# Altium project CHIP_v1_0.PrjPcb
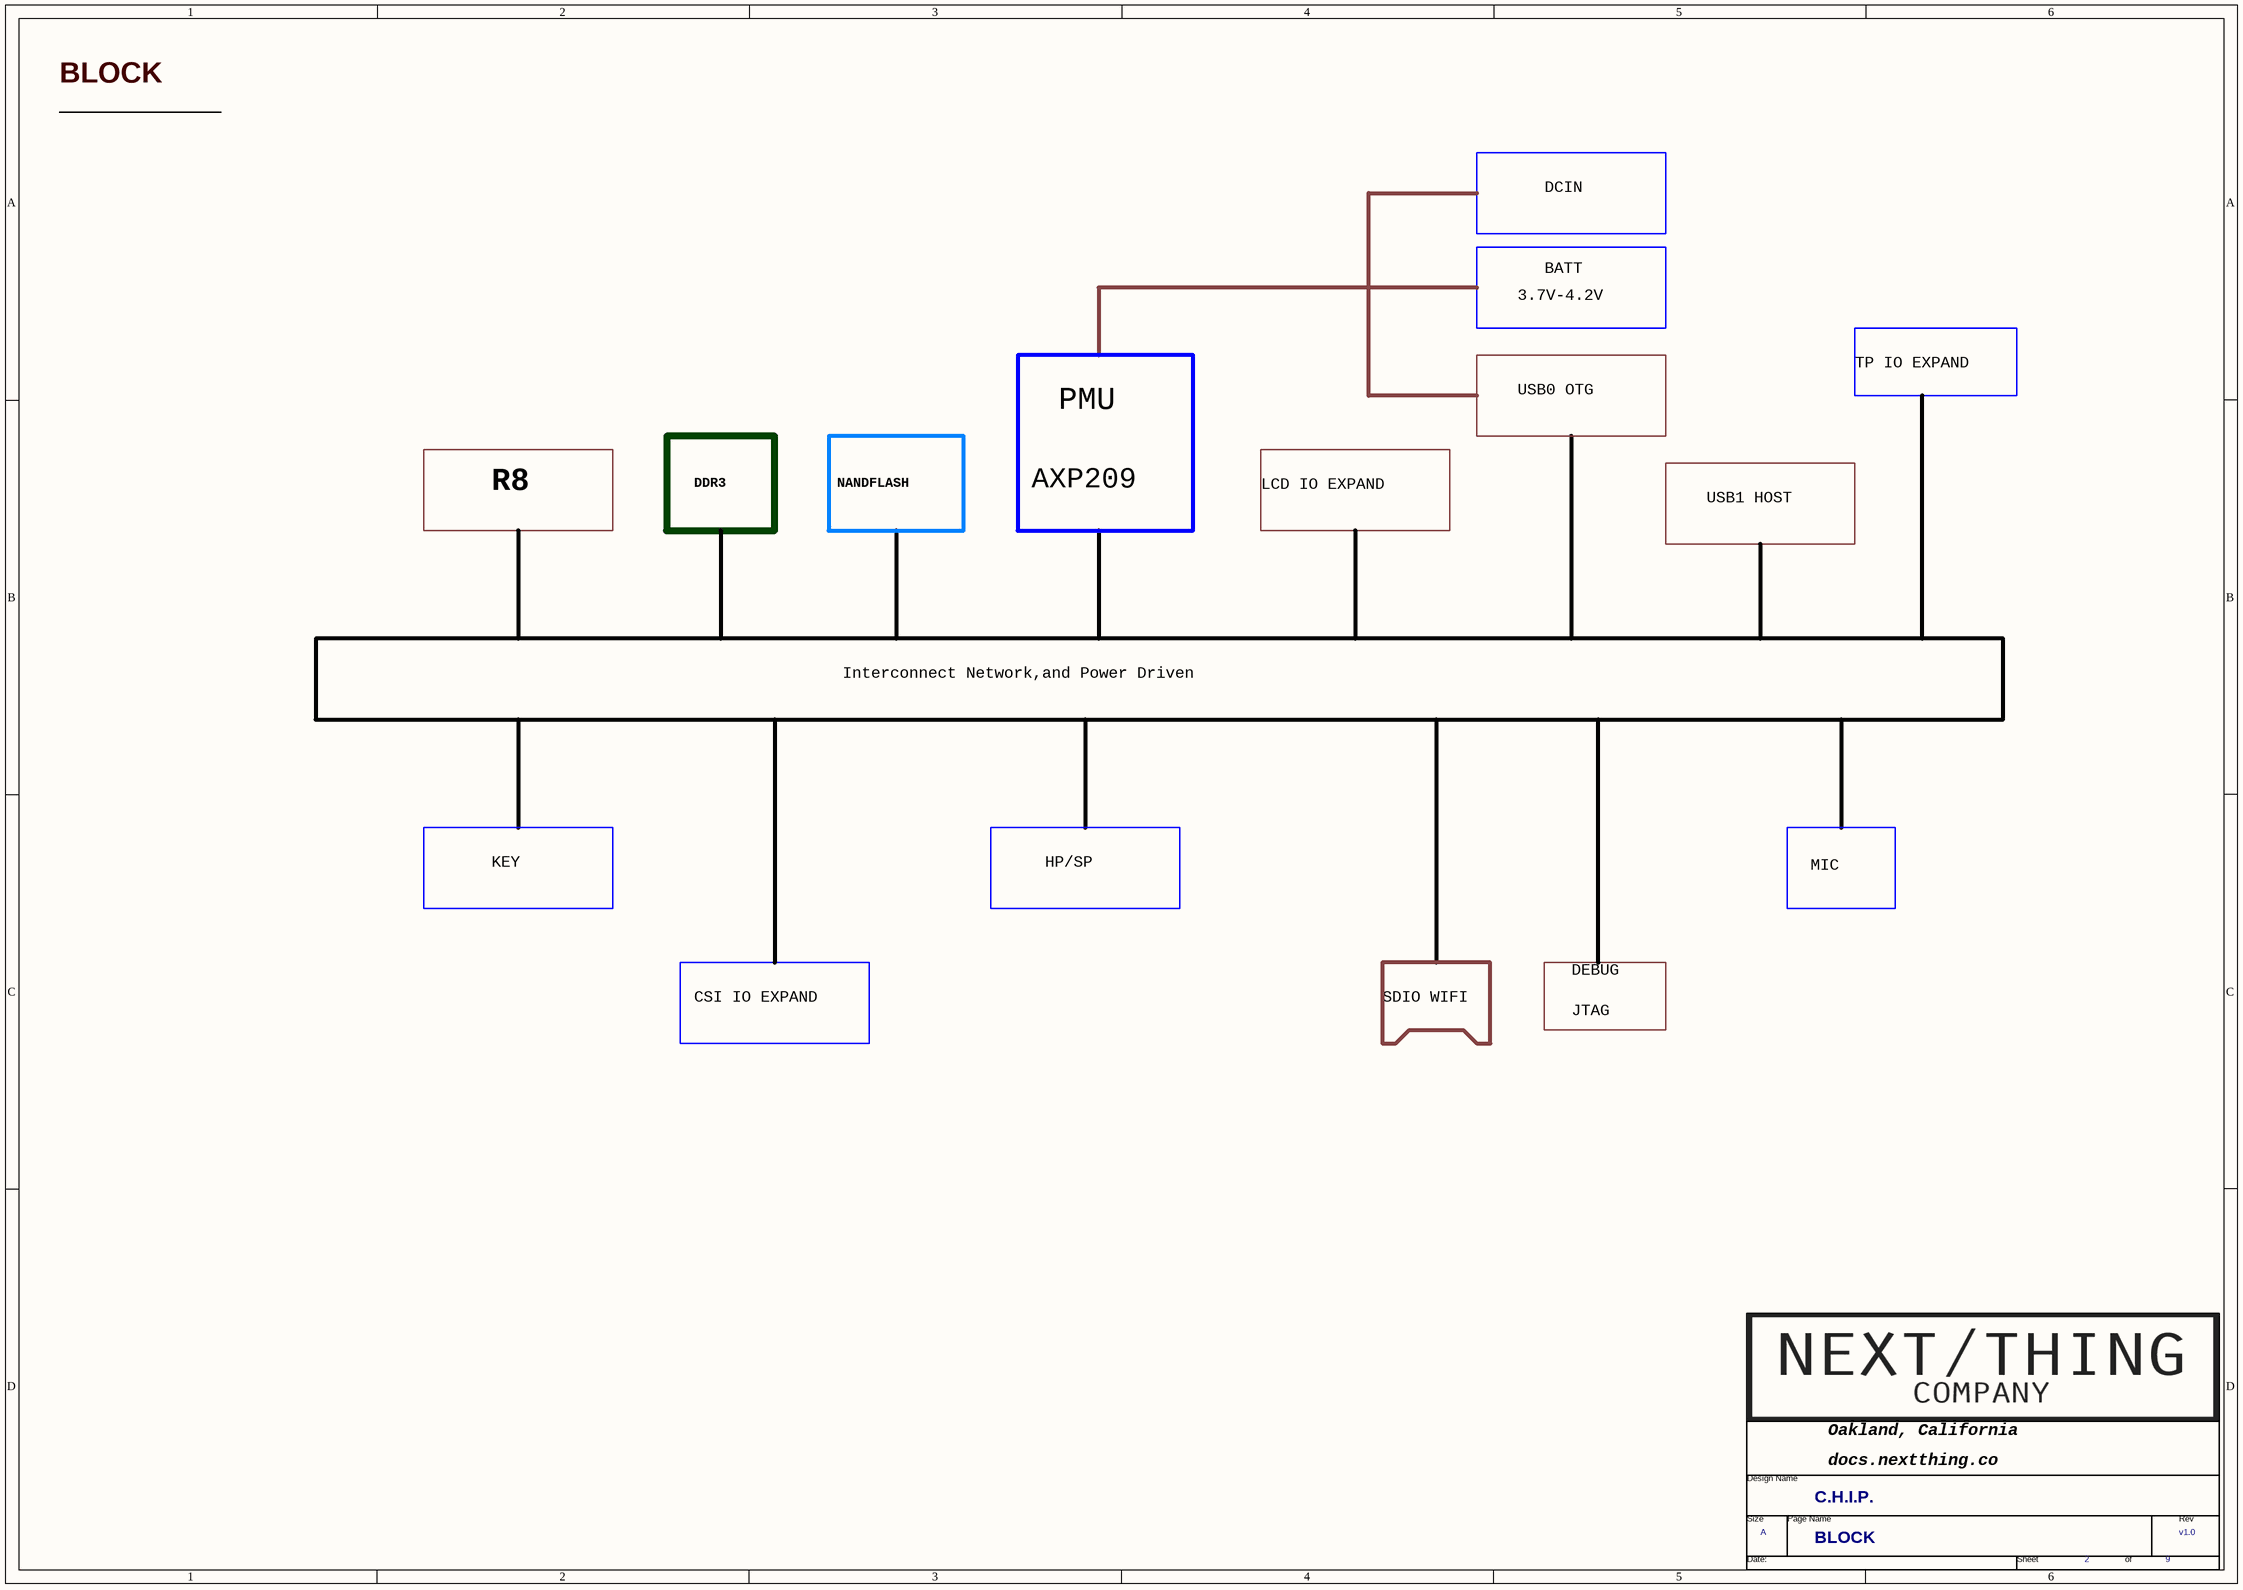
[diagram p0: 02 BLOCK.SchDoc]
4 sheets, 125 parts. Net scope: global (net labels, ports and power ports of the same name join across sheets).
Sheets:
  02 BLOCK.SchDoc
  05 MISC.SchDoc
  07 USB.SchDoc
  08 BESIDE CPU.SchDoc

## Sheet 02 BLOCK.SchDoc
size 420 x 297 mm

### Parts
(Parts that share a designator on the sheet are numbered #1, #2 ... from top to bottom, then left to right.)
*#1  Page Count: 9  Page Number: 2  Page Size: A  Title: C.H.I.P.  RevCode: v1.0  Doc: BLOCK  (hidden comment: TitleBlock1-nextthing)  (graphical)

### Notes on the sheet
- BLOCK
- DCIN
- 3.7V-4.2V
- BATT
- USB0 OTG
- TP IO EXPAND
- PMU
- R8
- DDR3
- NANDFLASH
- AXP209
- LCD IO EXPAND
- USB1 HOST
- Interconnect Network,and Power Driven
- KEY
- HP/SP
- MIC
- CSI IO EXPAND
- SDIO WIFI
- DEBUG
- JTAG
- (in symbol TitleBlock1-nextthing) Oakland, California; Design Name; docs.nextthing.co /; Size; Page Name; Rev; Date:; Sheet; of

### Library data of the parts
*#1 = TitleBlock1-nextthing: Page Create Date: March  8, 1995

## Sheet 05 MISC.SchDoc
size 420 x 297 mm
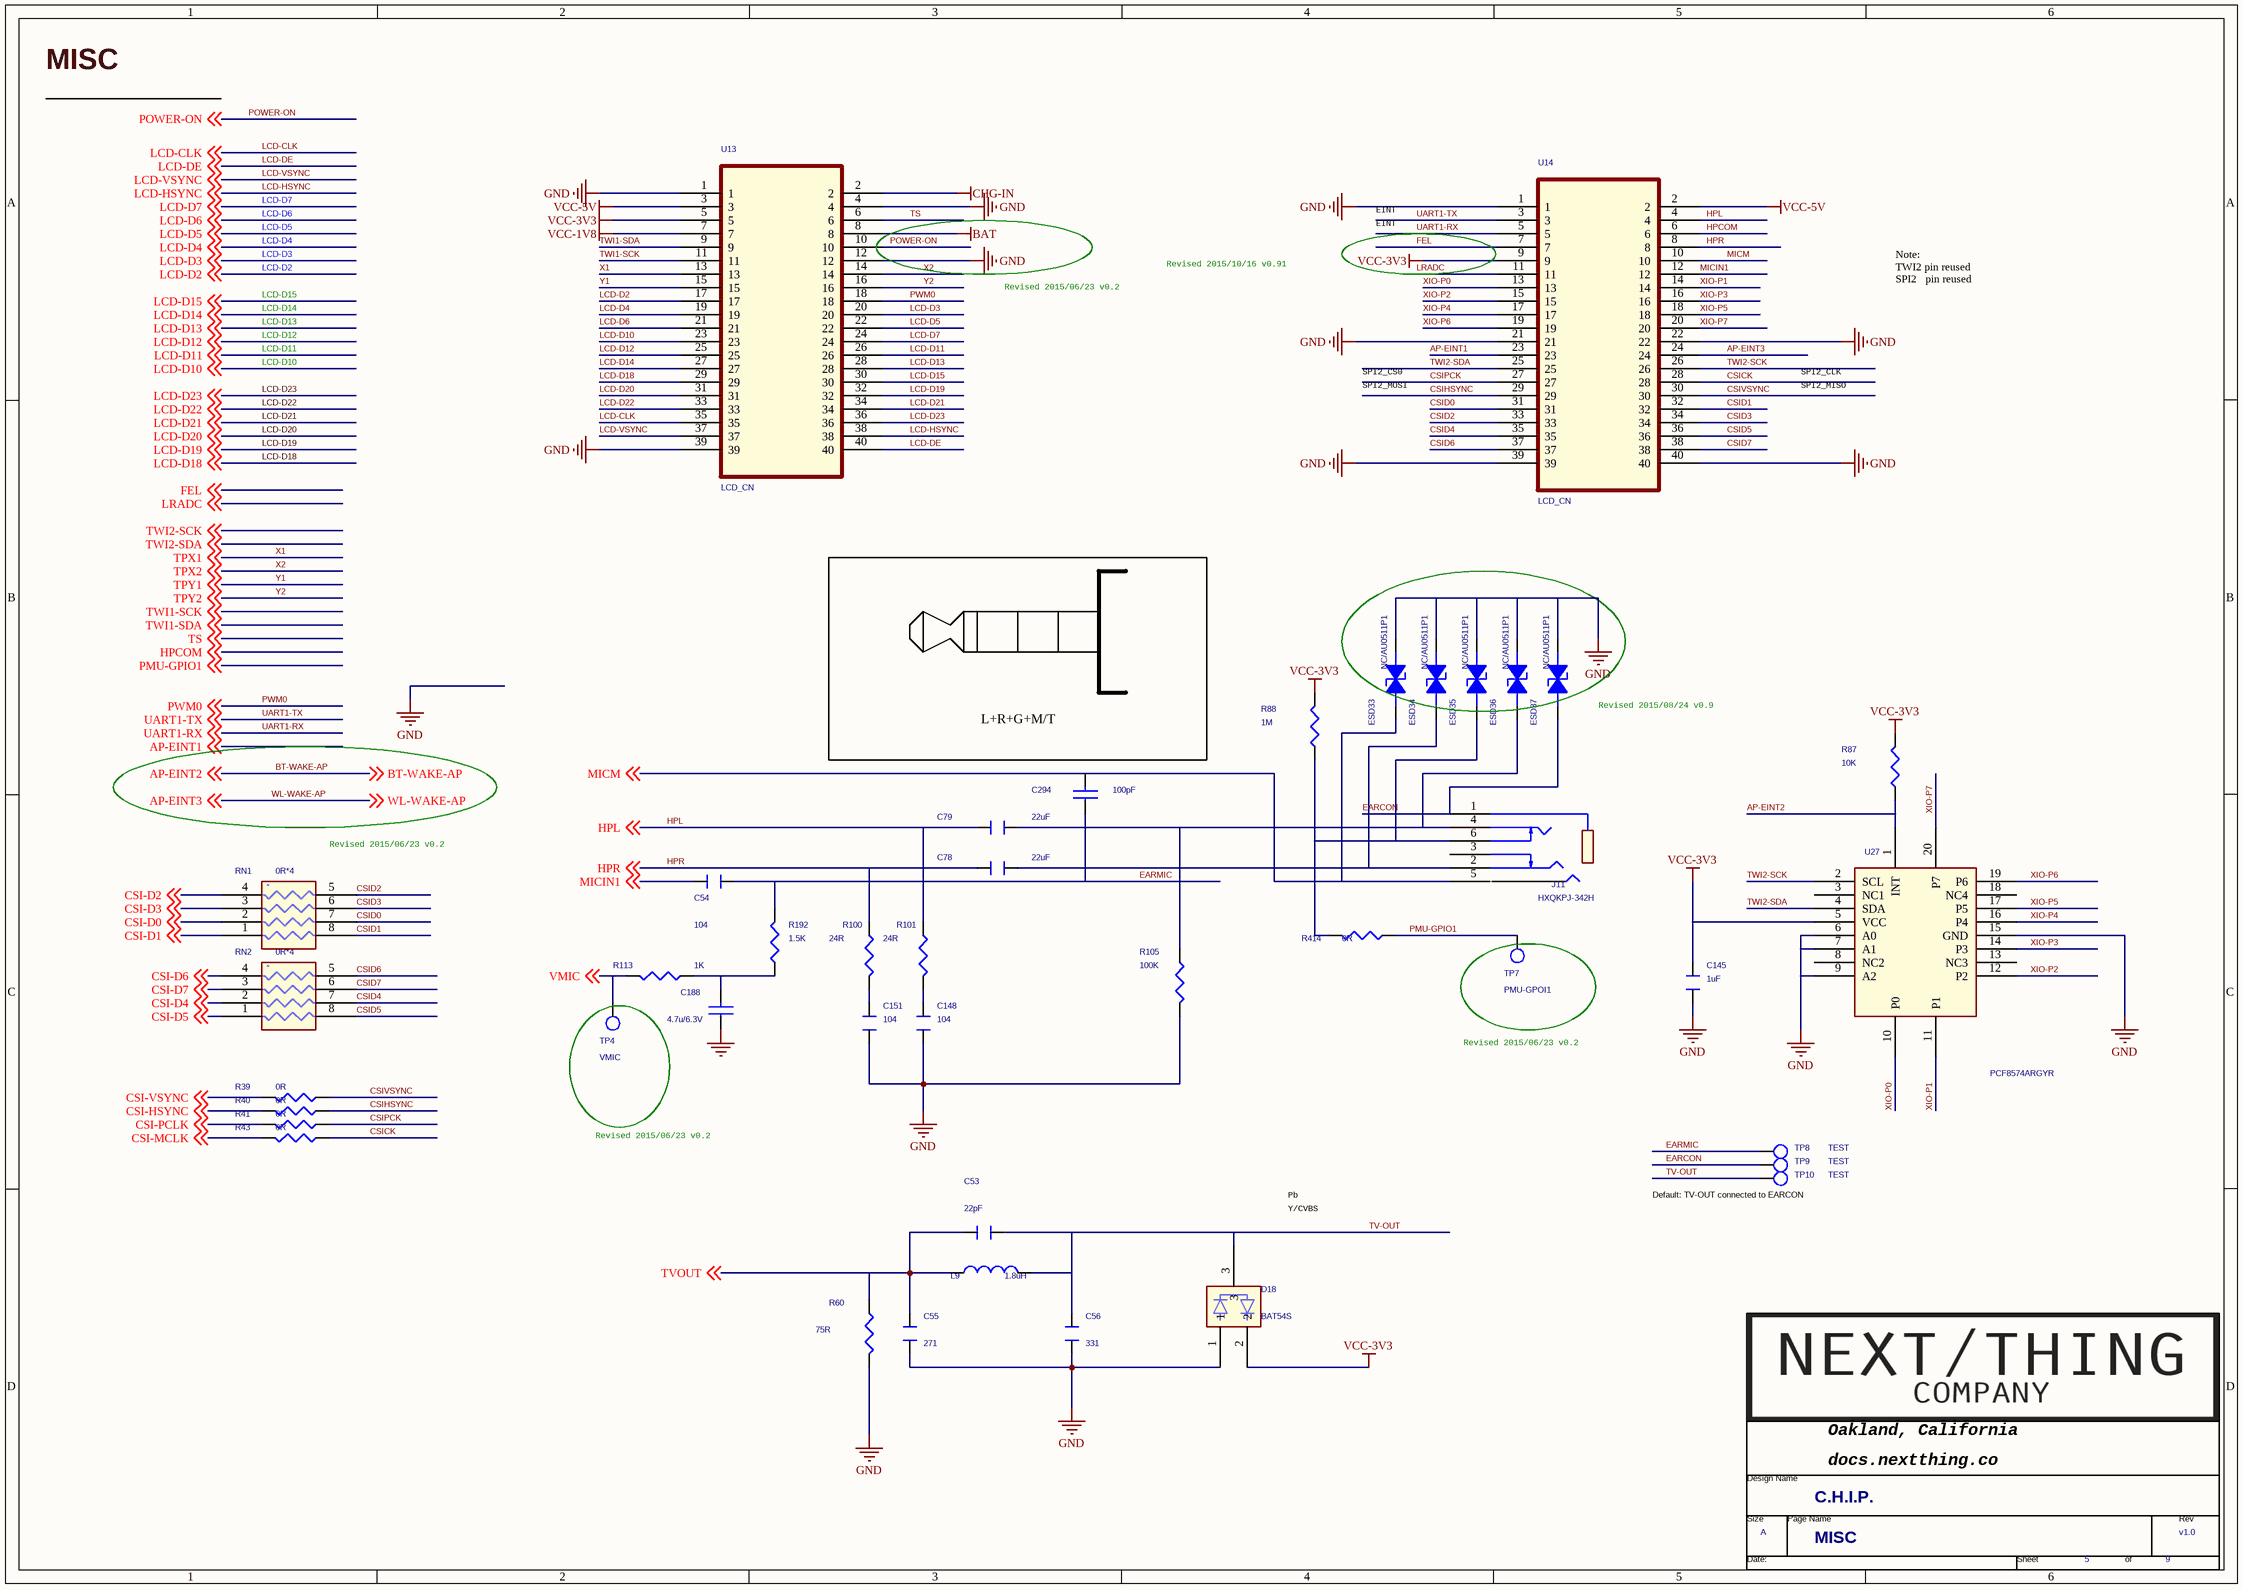
[diagram p1: 05 MISC.SchDoc]

### Parts
(Parts that share a designator on the sheet are numbered #1, #2 ... from top to bottom, then left to right.)
*#2  Page Count: 9  Page Number: 5  Page Size: A  Title: C.H.I.P.  RevCode: v1.0  Doc: MISC  (hidden comment: TitleBlock1-nextthing)  (graphical)
C53  22pF  [C0201]
C54  104  [C0201]
C55  271  [C0201]
C56  331  [C0201]
C78  22uF  [CC0805]
C79  22uF  [CC0805]
C145  1uF  [CC0402]
C148  104  [C0201]
C151  104  [C0201]
C188  4.7u/6.3V  [CC0603]
C294  100pF  [C0201]
D18  BAT54S  [SOT-23]
ESD33  NC/AU0511P1  [R0402]
ESD34  NC/AU0511P1  [R0402]
ESD35  NC/AU0511P1  [R0402]
ESD36  NC/AU0511P1  [R0402]
ESD37  NC/AU0511P1  [R0402]
J11  HXQKPJ-342H  [TSH-3865D]
L9  1.8uH  [L0603]
R39  0R  [R0603]
R40  0R  [R0603]
R41  0R  [R0603]
R43  0R  [R0603]
R60  75R  [C0201]
R87  10K  [C0201]
R88  1M  [C0201]
R100  24R  [R0402]
R101  24R  [R0402]
R105  100K  [R0402]
R113  1K  [C0201]
R192  1.5K  [C0201]
R414  0R  [0805]
RN1  0R*4  [RN0201]
RN2  0R*4  [RN0201]
TP4  VMIC  [TP40_SMD]
TP7  PMU-GPOI1  [TP40_SMD]
TP8  TEST  [TP30_SMD]
TP9  TEST  [TP30_SMD]
TP10  TEST  [TP30_SMD]
U13  LCD_CN  [CON2X20-PT2_54-5_2X31_2H2A]
U14  LCD_CN  [CON2X20-PT2_54-5_2X31_2H2A]
U27  PCF8574ARGYR  [SO16]

### Nets
BAT: U13.8
CHG-IN: U13.2
GND: C55.1 C56.1 C145.1 C148.2 C151.2 C188.1 D18.1 ESD33.1(ANODE) ESD34.1(ANODE) ESD35.1(ANODE) ESD36.1(ANODE) ESD37.1(ANODE) R60.2 R105.2 U13.1 U13.4 U13.12 U13.39 U14.1 U14.21 U14.22 U14.39 U14.40 U27.6(A0) U27.7(A1) U27.9(A2) U27.15(GND)
VCC-1V8: U13.7
VCC-3V3: C145.2 D18.2 R87.2 R88.2 U13.5 U14.9 U27.5(VCC)  [project net HPVCC]
VCC-5V: U13.3 U14.2
AP-EINT1: U14.23 ; off-sheet AP-EINT1
AP-EINT2: R87.1 U27.1(INT) ; off-sheet AP-EINT2, off-sheet BT-WAKE-AP  [also labelled BT-WAKE-AP]
AP-EINT3: U14.24 ; off-sheet AP-EINT3, off-sheet WL-WAKE-AP  [also labelled WL-WAKE-AP]
CSI-D0: RN1.2(R2) ; off-sheet CSI-D0
CSI-D1: RN1.1(R1) ; off-sheet CSI-D1
CSI-D2: RN1.4(R4) ; off-sheet CSI-D2
CSI-D3: RN1.3(R3) ; off-sheet CSI-D3
CSI-D4: RN2.2(R2) ; off-sheet CSI-D4
CSI-D5: RN2.1(R1) ; off-sheet CSI-D5
CSI-D6: RN2.4(R4) ; off-sheet CSI-D6
CSI-D7: RN2.3(R3) ; off-sheet CSI-D7
CSI-HSYNC: R40.1 ; off-sheet CSI-HSYNC
CSI-MCLK: R43.2 ; off-sheet CSI-MCLK
CSI-PCLK: R41.1 ; off-sheet CSI-PCLK
CSI-VSYNC: R39.1 ; off-sheet CSI-VSYNC
CSICK: R43.1 U14.28
CSID0: RN1.7(R7) U14.31
CSID1: RN1.8(R8) U14.32
CSID2: RN1.5(R5) U14.33
CSID3: RN1.6(R6) U14.34
CSID4: RN2.7(R7) U14.35
CSID5: RN2.8(R8) U14.36
CSID6: RN2.5(R5) U14.37
CSID7: RN2.6(R6) U14.38
CSIHSYNC: R40.2 U14.29
CSIPCK: R41.2 U14.27
CSIVSYNC: R39.2 U14.30
EARCON: ESD37.2(CATHODE) J11.1 TP9.1(TP)
EARMIC: C54.2 C294.1 R192.2 TP8.1(TP)
FEL: U14.7 ; off-sheet FEL
HPCOM: U14.6 ; off-sheet HPCOM
HPL: C79.1 R101.1 U14.4 ; off-sheet HPL
HPR: C78.1 R100.1 U14.8 ; off-sheet HPR
LCD-CLK: U13.35 ; off-sheet LCD-CLK
LCD-D2: U13.17 ; off-sheet LCD-D2
LCD-D3: U13.20 ; off-sheet LCD-D3
LCD-D4: U13.19 ; off-sheet LCD-D4
LCD-D5: U13.22 ; off-sheet LCD-D5
LCD-D6: U13.21 ; off-sheet LCD-D6
LCD-D7: U13.24 ; off-sheet LCD-D7
LCD-D10: U13.23 ; off-sheet LCD-D10
LCD-D11: U13.26 ; off-sheet LCD-D11
LCD-D12: U13.25 ; off-sheet LCD-D12
LCD-D13: U13.28 ; off-sheet LCD-D13
LCD-D14: U13.27 ; off-sheet LCD-D14
LCD-D15: U13.30 ; off-sheet LCD-D15
LCD-D18: U13.29 ; off-sheet LCD-D18
LCD-D19: U13.32 ; off-sheet LCD-D19
LCD-D20: U13.31 ; off-sheet LCD-D20
LCD-D21: U13.34 ; off-sheet LCD-D21
LCD-D22: U13.33 ; off-sheet LCD-D22
LCD-D23: U13.36 ; off-sheet LCD-D23
LCD-DE: U13.40 ; off-sheet LCD-DE
LCD-HSYNC: U13.38 ; off-sheet LCD-HSYNC
LCD-VSYNC: U13.37 ; off-sheet LCD-VSYNC
LRADC: U14.11 ; off-sheet LRADC
MICIN1: C54.1 U14.12 ; off-sheet MICIN1
MICM: C294.2 ESD33.2(CATHODE) J11.5 U14.10 ; off-sheet MICM
PMU-GPIO1: R414.1 TP7.1(TP) ; off-sheet PMU-GPIO1
POWER-ON: U13.10 ; off-sheet POWER-ON
PWM0: U13.18 ; off-sheet PWM0
TS: U13.6 ; off-sheet TS
TV-OUT: C53.2 C56.2 D18.3 L9.2 TP10.1(TP)
TVOUT: C53.1 C55.2 L9.1 R60.1 ; off-sheet TVOUT
TWI1-SCK: U13.11 ; off-sheet TWI1-SCK
TWI1-SDA: U13.9 ; off-sheet TWI1-SDA
TWI2-SCK: U14.26 U27.2(SCL) ; off-sheet TWI2-SCK
TWI2-SDA: U14.25 U27.4(SDA) ; off-sheet TWI2-SDA
UART1-RX: U14.5 ; off-sheet UART1-RX
UART1-TX: U14.3 ; off-sheet UART1-TX
VMIC: R113.2 TP4.1(TP) ; off-sheet VMIC
X1: U13.13 ; off-sheet TPX1  [also labelled TPX1]
X2: U13.14 ; off-sheet TPX2  [also labelled TPX2]
XIO-P0: U14.13 U27.10(P0)
XIO-P1: U14.14 U27.11(P1)
XIO-P2: U14.15 U27.12(P2)
XIO-P3: U14.16 U27.14(P3)
XIO-P4: U14.17 U27.16(P4)
XIO-P5: U14.18 U27.17(P5)
XIO-P6: U14.19 U27.19(P6)
XIO-P7: U14.20 U27.20(P7)
Y1: U13.15 ; off-sheet TPY1  [also labelled TPY1]
Y2: U13.16 ; off-sheet TPY2  [also labelled TPY2]
NetC78_2: C78.2 ESD34.2(CATHODE) J11.2
NetC79_2: C79.2 ESD36.2(CATHODE) J11.4 R105.1
NetC148_1: C148.1 R101.2
NetC151_1: C151.1 R100.2
NetC188_2: C188.2 R113.1 R192.1
NetESD35_2: ESD35.2(CATHODE) J11.6 R88.1 R414.2

Not connected (* = marked no-connect by the designer): J11 3; U27 3(NC1) 8(NC2) 13(NC3) 18(NC4)

### Notes on the sheet
- MISC
- EINT
- Note:
  TWI2 pin reused
  SPI2   pin reused
- Revised 2015/06/23 v0.2
- Revised 2015/10/16 v0.91
- SPI2_MOSI
- SPI2_CS0
- SPI2_MISO
- SPI2_CLK
- L+R+G+M/T
- (near ESD37) Revised 2015/08/24 v0.9
- (near RN1) Revised 2015/06/23 v0.2
- Pb
- (near TP10) Default: TV-OUT connected to EARCON
- Y/CVBS
- (in symbol TitleBlock1-nextthing) Oakland, California; Design Name; docs.nextthing.co /; Size; Page Name; Rev; Date:; Sheet; of

### Library data of the parts
C53-C56 C145 = CAPACITOR
C78 C79 = CAPACITOR_0: PAGE: 1
C148 C151 = CAPACITOR_0_Dup1: PAGE: 1
C188 = CAP NP: 0603 2.2uF X5R 6.3V +/-10%/0603 2.2uF X5R 6.3V +/-10%/0603 2.2uF X5R 6.3V +/-20%; Part Number: C0603B225K006AT/GRM185R60J225KE26/C0603B225M006AT; Singconn Part Number: EJ225K6V3631; SPREADWIN PN: C0200004A/C0200004C/C0200004D; Vendor: YIXING/MURATA/YIXING
C294 = CAP NP: 0402 100pF C0G 50V +/-5%; PART_NUMBER: GRM1555C1H180JZ01; Part Number: GRM1555C1H101JZ01/C0402CG101J050AT; Vendor: MURATA/YIXING; SPREADWIN PN: C0100019A/C0100019D
D18 = DIODE_DUAL
ESD33-ESD37 = 1_1.5KE100A: 1ST PART DESCRIPTION: WILL ESD9B5V Bidirection ESD Protection
J11 = PHONOJACK_1
L9 = INDUCTOR_1
R39-R41 R43 = RESISTOR_0
R60 = RESISTOR: ROOM: TVLCD
R87 R88 R113 R192 = RESISTOR_Dup1
R100 R101 R105 = ?_0_Dup1
R414 = R1 0805
RN1 RN2 = R-PACK4_1
TP4 TP7-TP10 = T_POINT_R_Dup1
U13 U14 = CNLCD_0
U27 = PCF8574T_1
*#2 = TitleBlock1-nextthing: Page Create Date: March  8, 1995

## Sheet 07 USB.SchDoc
size 420 x 297 mm
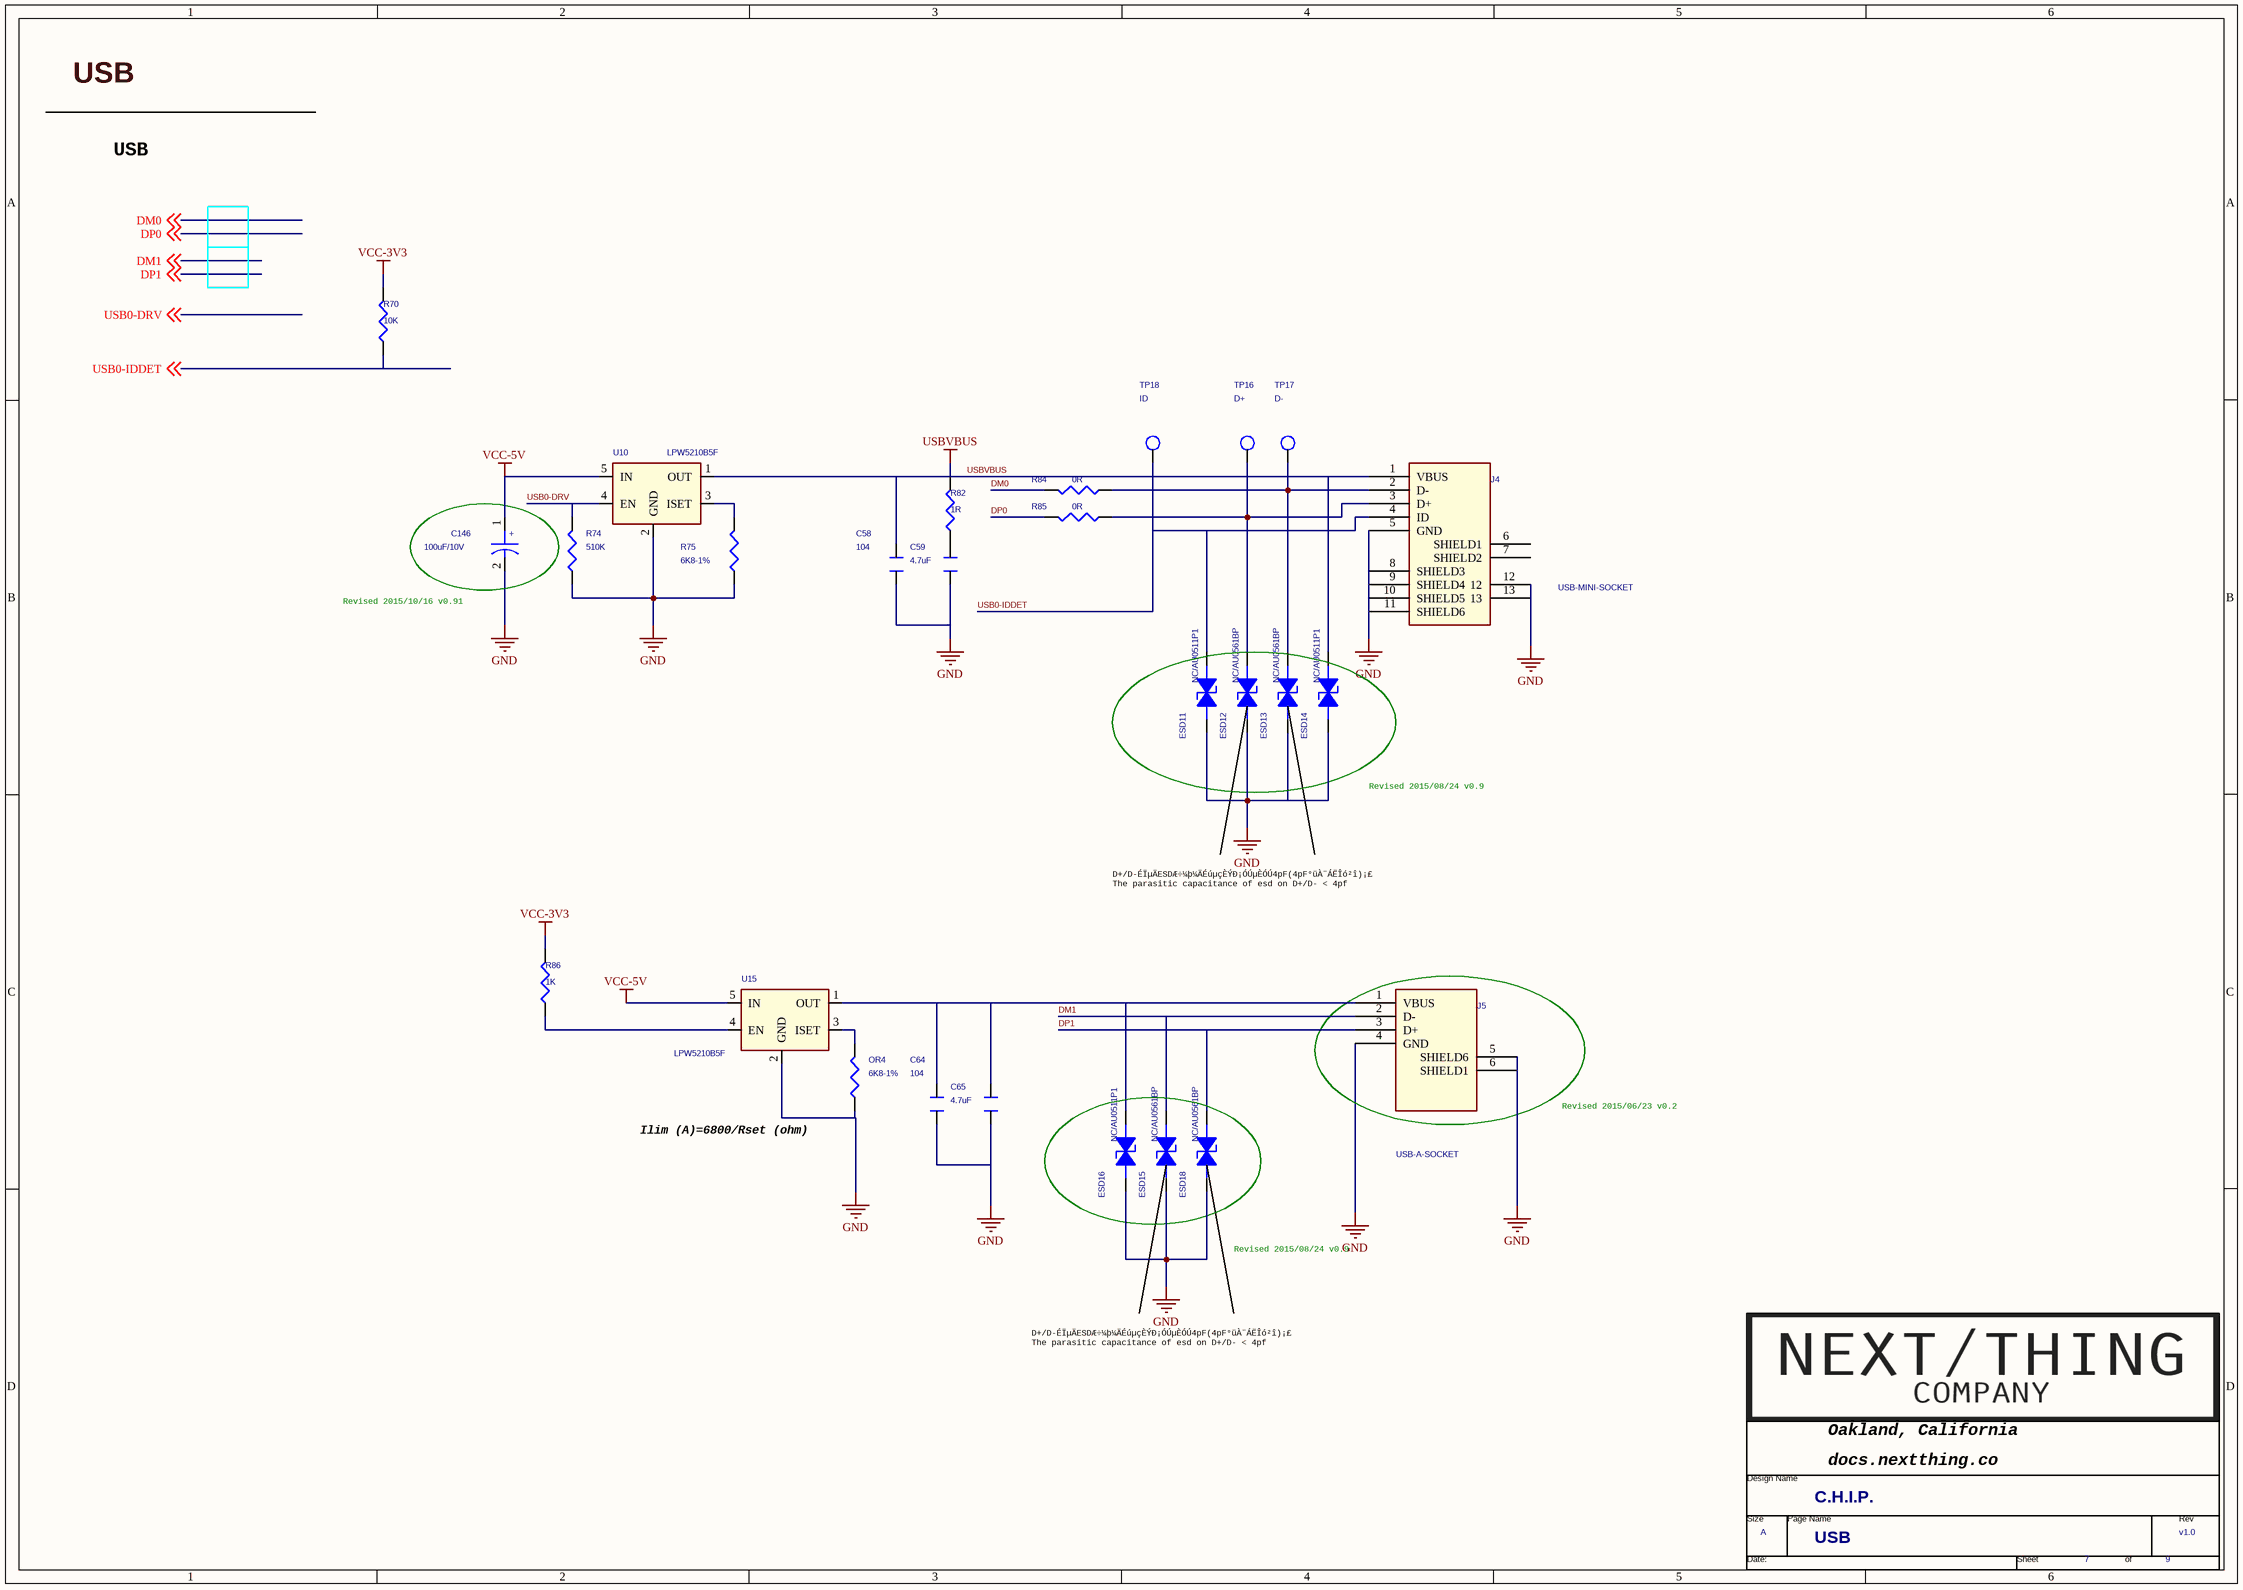
[diagram p2: 07 USB.SchDoc]

### Parts
(Parts that share a designator on the sheet are numbered #1, #2 ... from top to bottom, then left to right.)
*#3  Page Count: 9  Page Number: 7  Page Size: A  Title: C.H.I.P.  RevCode: v1.0  Doc: USB  (hidden comment: TitleBlock1-nextthing)  (graphical)
C58  104  [C0201]
C59  4.7uF  [CC0603]
C64  104  [C0201]
C65  4.7uF  [CC0603]
C146  100uF/10V  [CT1210]
ESD11  NC/AU0511P1  [R0402]
ESD12  NC/AU0561BP  [R0402]
ESD13  NC/AU0561BP  [R0402]
ESD14  NC/AU0511P1  [R0402]
ESD15  NC/AU0561BP  [R0402]
ESD16  NC/AU0511P1  [R0402]
ESD18  NC/AU0561BP  [R0402]
J4  USB-MINI-SOCKET  [USB_MINI_AB]
J5  USB-A-SOCKET  [USB_MINI_AB]
OR4  6K8-1%  [C0201]
R70  10K  [C0201]
R74  510K  [C0201]
R75  6K8-1%  [C0201]
R82  1R  [R0402]
R84  0R  [C0201]
R85  0R  [C0201]
R86  1K  [C0201]
TP16  D+  [tp40_smd]
TP17  D-  [tp40_smd]
TP18  ID  [tp40_smd]
U10  LPW5210B5F  [SOT23-6]
U15  LPW5210B5F  [SOT23-6]

### Nets
GND: C58.1 C59.1 C64.1 C65.1 C146.2 ESD11.2(CATHODE) ESD12.2(CATHODE) ESD13.2(CATHODE) ESD14.2(CATHODE) ESD15.2(CATHODE) ESD16.2(CATHODE) ESD18.2(CATHODE) J4.5(GND) J4.8(SHIELD3) J4.9(SHIELD4) J4.10(SHIELD5) J4.11(SHIELD6) J4.12 J4.13 J5.4(GND) J5.5(SHIELD6) J5.6(SHIELD1) OR4.1 R74.1 R75.1 U10.2(GND) U15.2(GND)
USBVBUS: C58.2 ESD14.1(ANODE) J4.1(VBUS) R82.2 U10.1(OUT)
VCC-3V3: R70.2 R86.2  [project net HPVCC]
VCC-5V: C146.1 U10.5(IN) U15.5(IN)
DM0: R84.2 ; off-sheet DM0
DM1: ESD15.1(ANODE) J5.2(D-) ; off-sheet DM1
DP0: R85.2 ; off-sheet DP0
DP1: ESD18.1(ANODE) J5.3(D+) ; off-sheet DP1
USB0-DRV: R74.2 U10.4(EN) ; off-sheet USB0-DRV
USB0-IDDET: ESD11.1(ANODE) J4.4(ID) R70.1 TP18.1(TP) ; off-sheet USB0-IDDET
NetC59_2: C59.2 R82.1
NetC64_2: C64.2 C65.2 ESD16.1(ANODE) J5.1(VBUS) U15.1(OUT)
NetESD12_1: ESD12.1(ANODE) J4.3(D+) R85.1 TP16.1(TP)
NetESD13_1: ESD13.1(ANODE) J4.2(D-) R84.1 TP17.1(TP)
NetOR4_2: OR4.2 U15.3(ISET)
NetR75_2: R75.2 U10.3(ISET)
NetR86_1: R86.1 U15.4(EN)

Not connected (* = marked no-connect by the designer): J4 6(SHIELD1) 7(SHIELD2)

### Notes on the sheet
- USB
- Revised 2015/10/16 v0.91
- Revised 2015/08/24 v0.9
- D+/D-ÉÏµÄESDÆ÷¼þ¼ÄÉúµçÈÝÐ¡ÓÚµÈÓÚ4pF(4pF°üÀ¨ÁËÎó²î)¡£
  The parasitic capacitance of esd on D+/D- < 4pf
- Ilim (A)=6800/Rset (ohm)
- Revised 2015/06/23 v0.2
- (in symbol CAPACITOR_POL) +
- (in symbol TitleBlock1-nextthing) Oakland, California; Design Name; docs.nextthing.co /; Size; Page Name; Rev; Date:; Sheet; of

### Library data of the parts
C58 C59 C64 C65 = CAPACITOR
C146 = CAPACITOR_POL: ROOM: MODEM
ESD11-ESD16 ESD18 = 1_1.5KE100A: as ESD33 on sheet 05 MISC
J4 = USB_MINI_SOCKET_2
J5 = USB_MINI_SOCKET_5
OR4 R70 R74 R75 R82 R86 = R_Dup2
R84 R85 = RESISTOR_Dup1
TP16-TP18 = T_POINT_R
U10 U15 = RT9266PE_2
*#3 = TitleBlock1-nextthing: Page Create Date: March  8, 1995

## Sheet 08 BESIDE CPU.SchDoc
size 420 x 297 mm
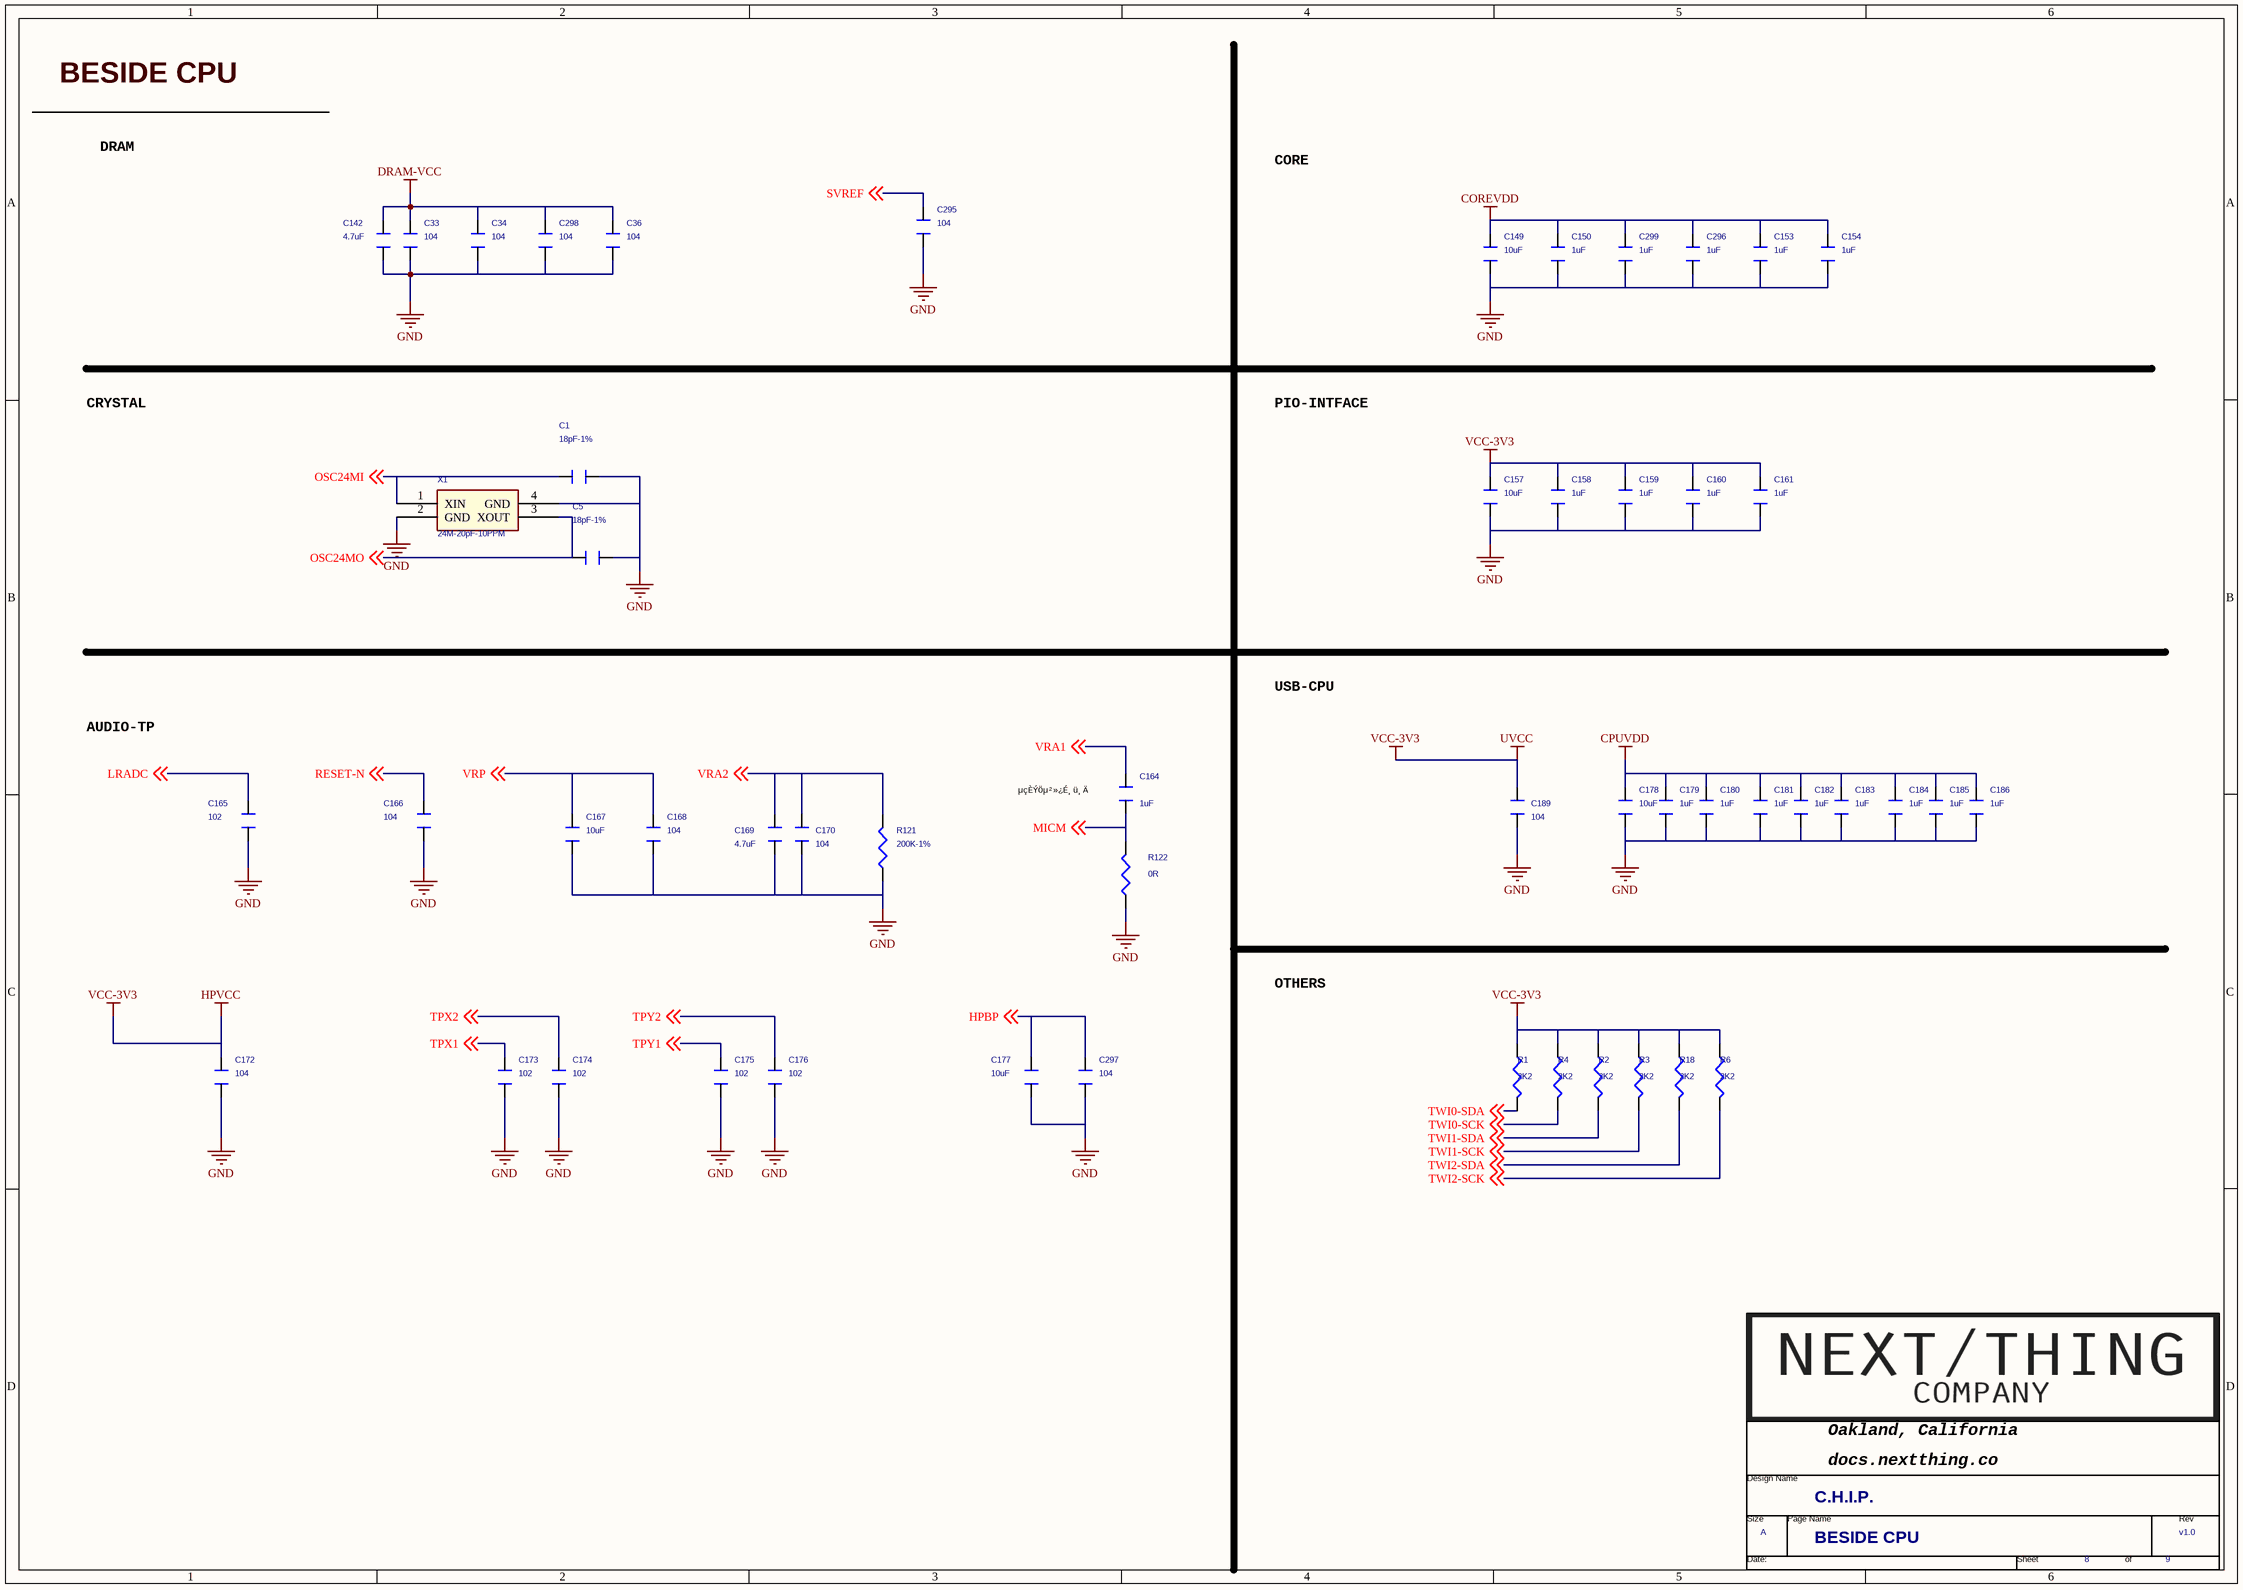
[diagram p3: 08 BESIDE CPU.SchDoc]

### Parts
(Parts that share a designator on the sheet are numbered #1, #2 ... from top to bottom, then left to right.)
*#4  Page Count: 9  Page Number: 8  Page Size: A  Title: C.H.I.P.  RevCode: v1.0  Doc: BESIDE CPU  (hidden comment: TitleBlock1-nextthing)  (graphical)
C1  18pF-1%  [C0201]
C5  18pF-1%  [C0201]
C33  104  [C0201]
C34  104  [C0201]
C36  104  [C0201]
C142  4.7uF  [C0402]
C149  10uF  [C0603]
C150  1uF  [C0402]
C153  1uF  [C0402]
C154  1uF  [C0402]
C157  10uF  [C0603]
C158  1uF  [C0402]
C159  1uF  [C0402]
C160  1uF  [C0402]
C161  1uF  [C0402]
C164  1uF  [C0402]
C165  102  [C0201]
C166  104  [C0201]
C167  10uF  [C0603]
C168  104  [C0201]
C169  4.7uF  [C0402]
C170  104  [C0201]
C172  104  [C0201]
C173  102  [C0201]
C174  102  [C0201]
C175  102  [C0201]
C176  102  [C0201]
C177  10uF  [C0603]
C178  10uF  [C0603]
C179  1uF  [C0402]
C180  1uF  [C0402]
C181  1uF  [C0402]
C182  1uF  [C0402]
C183  1uF  [C0402]
C184  1uF  [C0402]
C185  1uF  [C0402]
C186  1uF  [C0402]
C189  104  [C0201]
C295  104  [C0201]
C296  1uF  [C0402]
C297  104  [C0201]
C298  104  [C0201]
C299  1uF  [C0402]
R1  2K2  [C0201]
R2  2K2  [C0201]
R3  2K2  [C0201]
R4  2K2  [C0201]
R6  2K2  [C0201]
R18  2K2  [C0201]
R121  200K-1%  [C0201]
R122  0R  [C0201]
X1  24M-20pF-10PPM  [CRY-3225]

### Nets
COREVDD: C149.1 C150.1 C153.1 C154.1 C296.1 C299.1
CPUVDD: C178.1 C179.1 C180.1 C181.1 C182.1 C183.1 C184.1 C185.1 C186.1
DRAM-VCC: C33.2 C34.2 C36.2 C142.2 C298.2
GND: C1.1 C5.1 C33.1 C34.1 C36.1 C142.1 C149.2 C150.2 C153.2 C154.2 C157.2 C158.1 C159.1 C160.1 C161.1 C165.1 C166.1 C167.1 C168.1 C169.1 C170.1 C172.1 C173.1 C174.1 C175.1 C176.1 C177.1 C178.2 C179.2 C180.2 C181.2 C182.2 C183.2 C184.2 C185.2 C186.2 C189.1 C295.1 C296.2 C297.1 C298.1 C299.2 R121.1 R122.1 X1.2(GND) X1.4(GND)
HPVCC: C157.1 C158.2 C159.2 C160.2 C161.2 C172.2 C189.2 R1.1 R2.1 R3.1 R4.1 R6.1 R18.1  [also labelled UVCC, VCC-3V3]
HPBP: C177.2 C297.2 ; off-sheet HPBP
LRADC: C165.2 ; off-sheet LRADC
MICM: C164.1 R122.2 ; off-sheet MICM
OSC24MI: C1.2 X1.1(XIN) ; off-sheet OSC24MI
OSC24MO: C5.2 X1.3(XOUT) ; off-sheet OSC24MO
RESET-N: C166.2 ; off-sheet RESET-N
SVREF: C295.2 ; off-sheet SVREF
TPX1: C173.2 ; off-sheet TPX1  [project net X1]
TPX2: C174.2 ; off-sheet TPX2  [project net X2]
TPY1: C175.2 ; off-sheet TPY1  [project net Y1]
TPY2: C176.2 ; off-sheet TPY2  [project net Y2]
TWI0-SCK: R4.2 ; off-sheet TWI0-SCK
TWI0-SDA: R1.2 ; off-sheet TWI0-SDA
TWI1-SCK: R3.2 ; off-sheet TWI1-SCK
TWI1-SDA: R2.2 ; off-sheet TWI1-SDA
TWI2-SCK: R6.2 ; off-sheet TWI2-SCK
TWI2-SDA: R18.2 ; off-sheet TWI2-SDA
VRA1: C164.2 ; off-sheet VRA1
VRA2: C169.2 C170.2 R121.2 ; off-sheet VRA2
VRP: C167.2 C168.2 ; off-sheet VRP

### Notes on the sheet
- BESIDE CPU
- DRAM
- CORE
- CRYSTAL
- PIO-INTFACE
- AUDIO-TP
- USB-CPU
- µçÈÝÖµ²»¿É¸ü¸Ä
- OTHERS
- (in symbol TitleBlock1-nextthing) Oakland, California; Design Name; docs.nextthing.co /; Size; Page Name; Rev; Date:; Sheet; of

### Library data of the parts
C1 C5 C33 C34 C36 C142 C158-C161 C167 C173-C177 C295 C297 C298 = CAPACITOR_0_Dup4: PAGE: 2
C149 C150 C153 C154 C157 C178-C186 C296 C299 = CAPACITOR_0_Dup3: PAGE: 1
C164-C166 C168-C170 = CAPACITOR_0_Dup4
C172 C189 = CAPACITOR_0_Dup4: PAGE: 3
R1-R4 R6 R18 R121 R122 = R_Dup2
X1 = CRYSTAL-4_3: Crystal 24MHz 20pF 10ppm  -30 to +85; PART NUMBER: 7M24000004; Vendor: TXC; SPREADWIN PN: U3000019A
*#4 = TitleBlock1-nextthing: Page Create Date: March  8, 1995

## Nets that join several sheets
GND: 05 MISC (27 pins), 07 USB (27 pins), 08 BESIDE CPU (46 pins)
HPVCC: 05 MISC (7 pins), 07 USB (R70.2 R86.2), 08 BESIDE CPU (13 pins)
VCC-5V: 05 MISC (U13.3 U14.2), 07 USB (C146.1 U10.5 U15.5)
LRADC: 05 MISC (U14.11), 08 BESIDE CPU (C165.2)
MICM: 05 MISC (C294.2 ESD33.2 J11.5 U14.10), 08 BESIDE CPU (C164.1 R122.2)
TWI1-SCK: 05 MISC (U13.11), 08 BESIDE CPU (R3.2)
TWI1-SDA: 05 MISC (U13.9), 08 BESIDE CPU (R2.2)
TWI2-SCK: 05 MISC (U14.26 U27.2), 08 BESIDE CPU (R6.2)
TWI2-SDA: 05 MISC (U14.25 U27.4), 08 BESIDE CPU (R18.2)
X1: 05 MISC (U13.13), 08 BESIDE CPU (C173.2)
X2: 05 MISC (U13.14), 08 BESIDE CPU (C174.2)
Y1: 05 MISC (U13.15), 08 BESIDE CPU (C175.2)
Y2: 05 MISC (U13.16), 08 BESIDE CPU (C176.2)